# Altium schematic sheet 2014_FDP_SCHEMA.SchDoc
size A3
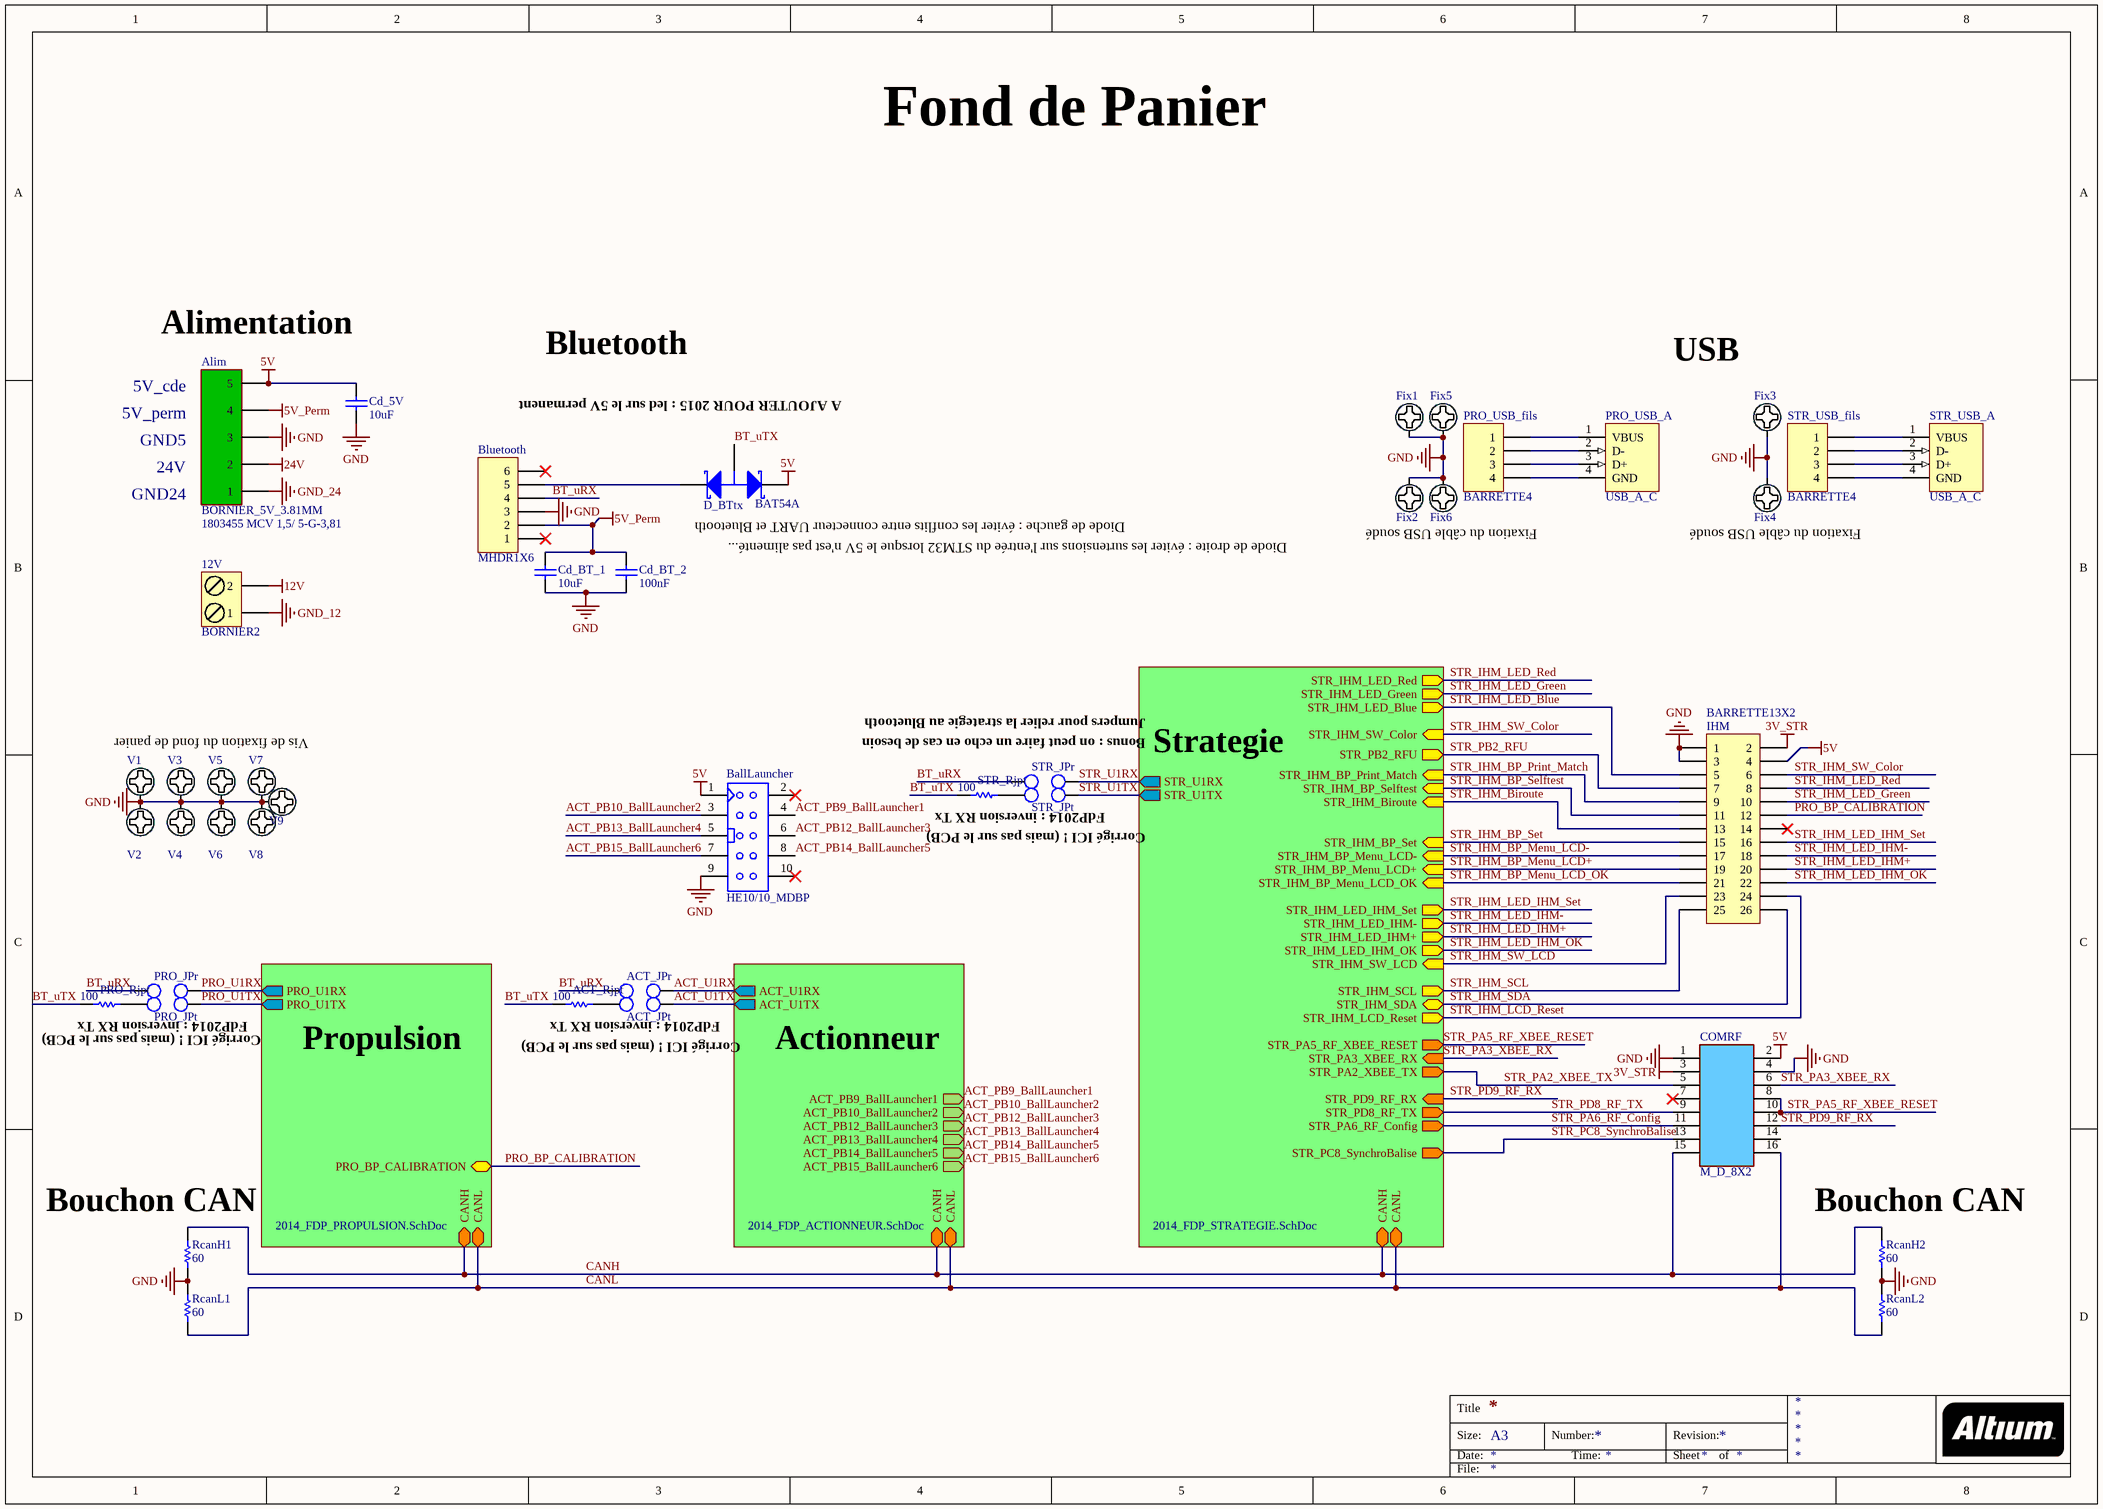
[diagram p0: 2014_FDP_SCHEMA.SchDoc]

## Parts
12V  BORNIER2  [BORNIER2]
ACT_JPr  JUMPER2  [BARRETTE_2_M_D]  (value not drawn)
ACT_JPt  JUMPER2  [BARRETTE_2_M_D]  (value not drawn)
ACT_Rjpt  100  [R1206_N]
Alim  BORNIER_5V_3.81MM  Ref: 1803455 MCV 1,5/ 5-G-3,81  [BORNIER_5V_3.81MM]
BallLauncher  Type: HE10/10_MDBP  [HE10/10_M_D_BP]  (hidden comment: HE10/10_MALE_DROIT_BAS_PROFIL)
Bluetooth  MHDR1X6  [HE14_6]
Cd_5V  10uF  [C1206_N]
Cd_BT_1  10uF  [C1206_N]
Cd_BT_2  100nF  [C0805_N]
COMRF  Type: M_D_8X2  [HE10/16_M_D_B P]  (hidden comment: BARRETTE_8 CONTACTS_2 RANGEES_MALE_DROITE)
D_BTtx  BAT54A  [SOT23-3N]
Fix1  Pad_M3  [M3x6mm Torx]  (value not drawn)
Fix2  Pad_M3  [M3x6mm Torx]  (value not drawn)
Fix3  Pad_M3  [M3x6mm Torx]  (value not drawn)
Fix4  Pad_M3  [M3x6mm Torx]  (value not drawn)
Fix5  Pad_M3  [M3x6mm Torx]  (value not drawn)
Fix6  Pad_M3  [M3x6mm Torx]  (value not drawn)
IHM  BARRETTE13X2  [HE10/26_M_D_BP]
PRO_JPr  JUMPER2  [BARRETTE_2_M_D]  (value not drawn)
PRO_JPt  JUMPER2  [BARRETTE_2_M_D]  (value not drawn)
PRO_Rjpt  100  [R1206_N]
PRO_USB_A  USB_A_COUDEE  [USB_A_C]  (value not drawn)
PRO_USB_fils  BARRETTE4  [HE14_4]
RcanH1  60  [R1206_N]
RcanH2  60  [R1206_N]
RcanL1  60  [R1206_N]
RcanL2  60  [R1206_N]
STR_JPr  JUMPER2  [BARRETTE_2_M_D]  (value not drawn)
STR_JPt  JUMPER2  [BARRETTE_2_M_D]  (value not drawn)
STR_Rjpt  100  [R1206_N]
STR_USB_A  USB_A_COUDEE  [USB_A_C]  (value not drawn)
STR_USB_fils  BARRETTE4  [HE14_4]
V1  Pad_M3  [M3x6mm Torx]  (value not drawn)
V2  Pad_M3  [M3x6mm Torx]  (value not drawn)
V3  Pad_M3  [M3x6mm Torx]  (value not drawn)
V4  Pad_M3  [M3x6mm Torx]  (value not drawn)
V5  Pad_M3  [M3x6mm Torx]  (value not drawn)
V6  Pad_M3  [M3x6mm Torx]  (value not drawn)
V7  Pad_M3  [M3x6mm Torx]  (value not drawn)
V8  Pad_M3  [M3x6mm Torx]  (value not drawn)
V9  Pad_M3  [M3x6mm Torx]  (value not drawn)

## Sub-sheets
Actionneur = 2014_FDP_ACTIONNEUR.SchDoc: CANH (bidir), CANL (bidir), ACT_PB9_BallLauncher1 (out), ACT_PB10_BallLauncher2 (out), ACT_PB12_BallLauncher3 (out), ACT_PB13_BallLauncher4 (out), ACT_PB14_BallLauncher5 (out), ACT_PB15_BallLauncher6 (out), ACT_U1RX (out), ACT_U1TX (out)
Propulsion = 2014_FDP_PROPULSION.SchDoc: PRO_BP_CALIBRATION, CANH (bidir), CANL (bidir), PRO_U1RX (out), PRO_U1TX (out)
Strategie = 2014_FDP_STRATEGIE.SchDoc: STR_IHM_BP_Set (in), STR_IHM_SW_LCD (in), STR_IHM_BP_Print_Match (in), STR_IHM_Biroute (in), STR_IHM_SW_Color (in), STR_IHM_BP_Selftest (in), STR_IHM_BP_Menu_LCD- (in), STR_IHM_BP_Menu_LCD+ (in), STR_IHM_SCL (out), STR_IHM_SDA (bidir), STR_IHM_LCD_Reset (out), STR_PA3_XBEE_RX (in), STR_PA2_XBEE_TX (out), STR_PA5_RF_XBEE_RESET (out), STR_PA6_RF_Config (out), STR_PC8_SynchroBalise (out), STR_PD8_RF_TX (out), STR_PD9_RF_RX (in), STR_IHM_BP_Menu_LCD_OK (in), STR_IHM_LED_Green (out), STR_IHM_LED_Red (out), STR_IHM_LED_IHM_OK (out), STR_IHM_LED_IHM+ (out), STR_IHM_LED_IHM- (out), STR_IHM_LED_IHM_Set (out), STR_PB2_RFU (out), CANL (bidir), CANH (bidir), STR_U1RX (out), STR_U1TX (out), STR_IHM_LED_Blue (out)

## Nets
3V_STR: COMRF.3 IHM.2
5V: Alim.5 BallLauncher.1 Cd_5V.2 COMRF.2 D_BTtx.2(K2) IHM.4
5V_Perm: Alim.4 Bluetooth.2 Cd_BT_1.2 Cd_BT_2.2
12V: 12V.2
24V: Alim.2
GND: Alim.3 BallLauncher.9 Bluetooth.3 Cd_5V.1 Cd_BT_1.1 Cd_BT_2.1 COMRF.1 COMRF.4 Fix1.1 Fix2.1 Fix3.1 Fix4.1 Fix5.1 Fix6.1 IHM.1 IHM.3 RcanH1.1 RcanH2.2 RcanL1.2 RcanL2.2 V1.1 V2.1 V3.1 V4.1 V5.1 V6.1 V7.1 V8.1 V9.1
GND_12: 12V.1
GND_24: Alim.1
ACT_PB9_BallLauncher1: BallLauncher.4 ; sheet Actionneur/ACT_PB9_BallLauncher1
ACT_PB10_BallLauncher2: BallLauncher.3 ; sheet Actionneur/ACT_PB10_BallLauncher2
ACT_PB12_BallLauncher3: BallLauncher.6 ; sheet Actionneur/ACT_PB12_BallLauncher3
ACT_PB13_BallLauncher4: BallLauncher.5 ; sheet Actionneur/ACT_PB13_BallLauncher4
ACT_PB14_BallLauncher5: BallLauncher.8 ; sheet Actionneur/ACT_PB14_BallLauncher5
ACT_PB15_BallLauncher6: BallLauncher.7 ; sheet Actionneur/ACT_PB15_BallLauncher6
ACT_U1RX: ACT_JPr.2 ; sheet Actionneur/ACT_U1RX
ACT_U1TX: ACT_JPt.2 ; sheet Actionneur/ACT_U1TX
BT_uRX: ACT_JPr.1 Bluetooth.4 PRO_JPr.1 STR_JPr.1
BT_uTX: ACT_Rjpt.2 D_BTtx.3(A) PRO_Rjpt.2 STR_Rjpt.2
CANH: COMRF.15 RcanH1.2 RcanH2.1 ; sheet Propulsion/CANH, sheet Strategie/CANH, sheet Actionneur/CANH
CANL: COMRF.16 RcanL1.1 RcanL2.1 ; sheet Propulsion/CANL, sheet Strategie/CANL, sheet Actionneur/CANL
PRO_BP_CALIBRATION: IHM.12 ; sheet Propulsion/PRO_BP_CALIBRATION
PRO_U1RX: PRO_JPr.2 ; sheet Propulsion/PRO_U1RX
PRO_U1TX: PRO_JPt.2 ; sheet Propulsion/PRO_U1TX
STR_IHM_Biroute: IHM.13 ; sheet Strategie/STR_IHM_Biroute
STR_IHM_BP_Menu_LCD+: IHM.19 ; sheet Strategie/STR_IHM_BP_Menu_LCD+
STR_IHM_BP_Menu_LCD-: IHM.17 ; sheet Strategie/STR_IHM_BP_Menu_LCD-
STR_IHM_BP_Menu_LCD_OK: IHM.21 ; sheet Strategie/STR_IHM_BP_Menu_LCD_OK
STR_IHM_BP_Print_Match: IHM.9 ; sheet Strategie/STR_IHM_BP_Print_Match
STR_IHM_BP_Selftest: IHM.11 ; sheet Strategie/STR_IHM_BP_Selftest
STR_IHM_BP_Set: IHM.15 ; sheet Strategie/STR_IHM_BP_Set
STR_IHM_LCD_Reset: IHM.24 ; sheet Strategie/STR_IHM_LCD_Reset
STR_IHM_LED_Blue: IHM.5 ; sheet Strategie/STR_IHM_LED_Blue
STR_IHM_LED_Green: IHM.10 ; sheet Strategie/STR_IHM_LED_Green
STR_IHM_LED_IHM+: IHM.20 ; sheet Strategie/STR_IHM_LED_IHM+
STR_IHM_LED_IHM-: IHM.18 ; sheet Strategie/STR_IHM_LED_IHM-
STR_IHM_LED_IHM_OK: IHM.22 ; sheet Strategie/STR_IHM_LED_IHM_OK
STR_IHM_LED_IHM_Set: IHM.16 ; sheet Strategie/STR_IHM_LED_IHM_Set
STR_IHM_LED_Red: IHM.8 ; sheet Strategie/STR_IHM_LED_Red
STR_IHM_SCL: IHM.25 ; sheet Strategie/STR_IHM_SCL
STR_IHM_SDA: IHM.26 ; sheet Strategie/STR_IHM_SDA
STR_IHM_SW_Color: IHM.6 ; sheet Strategie/STR_IHM_SW_Color
STR_IHM_SW_LCD: IHM.23 ; sheet Strategie/STR_IHM_SW_LCD
STR_PA2_XBEE_TX: COMRF.5 ; sheet Strategie/STR_PA2_XBEE_TX
STR_PA3_XBEE_RX: COMRF.6 ; sheet Strategie/STR_PA3_XBEE_RX
STR_PA5_RF_XBEE_RESET: COMRF.8 COMRF.10 ; sheet Strategie/STR_PA5_RF_XBEE_RESET
STR_PA6_RF_Config: COMRF.11 ; sheet Strategie/STR_PA6_RF_Config
STR_PB2_RFU: IHM.7 ; sheet Strategie/STR_PB2_RFU
STR_PC8_SynchroBalise: COMRF.13 ; sheet Strategie/STR_PC8_SynchroBalise
STR_PD8_RF_TX: COMRF.9 ; sheet Strategie/STR_PD8_RF_TX
STR_PD9_RF_RX: COMRF.12 ; sheet Strategie/STR_PD9_RF_RX
STR_U1RX: STR_JPr.2 ; sheet Strategie/STR_U1RX
STR_U1TX: STR_JPt.2 ; sheet Strategie/STR_U1TX
NetACT_JPt_1: ACT_JPt.1 ACT_Rjpt.1
NetBluetooth_5: Bluetooth.5 D_BTtx.1(K1)
NetPRO_JPt_1: PRO_JPt.1 PRO_Rjpt.1
NetPRO_USB_A_1: PRO_USB_A.1(VBUS) PRO_USB_fils.1
NetPRO_USB_A_2: PRO_USB_A.2(D-) PRO_USB_fils.2
NetPRO_USB_A_3: PRO_USB_A.3(D+) PRO_USB_fils.3
NetPRO_USB_A_4: PRO_USB_A.4(GND) PRO_USB_fils.4
NetSTR_JPt_1: STR_JPt.1 STR_Rjpt.1
NetSTR_USB_A_1: STR_USB_A.1(VBUS) STR_USB_fils.1
NetSTR_USB_A_2: STR_USB_A.2(D-) STR_USB_fils.2
NetSTR_USB_A_3: STR_USB_A.3(D+) STR_USB_fils.3
NetSTR_USB_A_4: STR_USB_A.4(GND) STR_USB_fils.4

Not connected (* = marked no-connect by the designer): BallLauncher 2* 10*; Bluetooth 1* 6*; COMRF 7* 14; IHM 14*

## Notes on the sheet
- Fond de Panier
- Alimentation
- Bluetooth
- USB
- 5V_perm
- 5V_cde
- GND5
- A AJOUTER POUR 2015 : led sur le 5V permanent
- 24V
- GND24
- Diode de gauche : éviter les conflits entre connecteur UART et Bluetooth
- (near Cd_BT_2) Diode de droite : éviter les surtensions sur l'entrée du STM32 lorsque le 5V n'est pas alimenté...
- Fixation du câble USB soudé
- Jumpers pour relier la strategie au Bluetooth
- Vis de fixation du fond de panier
- Bonus : on peut faire un echo en cas de besoin
- FdP2014 : inversion RX Tx
- Corrigé ICI ! (mais pas sur le PCB)
- (near RcanH1) Bouchon CAN
- (near RcanH2) Bouchon CAN
- Title
- Size:
- Date:
- A3
- Number:
- Time:
- Revision:
- Sheet
- of
- File:

## Library data of the parts
12V = BORNIER2: Terminal blocks, 2 pins, pitch=5mm
ACT_JPr ACT_JPt PRO_JPr PRO_JPt STR_JPr STR_JPt = JUMPER2: BARRETTE 2 CONTACTS 1 RANGEE MALE DROITE; Type: JUMPER2
ACT_Rjpt PRO_Rjpt RcanH1 RcanH2 RcanL1 RcanL2 STR_Rjpt = Resistor: Published: 8-Jun-2000; LatestRevisionDate: 17-Jul-2002; LatestRevisionNote: Re-released for DXP Platform.; PackageReference: AXIAL-0.5; Publisher: Altium Limited
BallLauncher = HE10/10_MALE_DROIT_BAS_PROFIL: EMBASE HE10/10 MALE DROIT BAS PROFIL
Bluetooth = MHDR1X6: Header, 6-Pin; LatestRevisionDate: 17-Jul-2002; LatestRevisionNote: Re-released for DXP Platform.; Publisher: Altium Limited
Cd_5V Cd_BT_1 Cd_BT_2 = Condensateur: Capacitor; Published: 8-Jun-2000; LatestRevisionDate: 17-Jul-2002; LatestRevisionNote: Re-released for DXP Platform.; PackageReference: RAD-0.3; Publisher: Altium Limited
D_BTtx = Diode Shottky double  BAT54A: DIODE SCHOTTKY DOUBLE; Manufacturer: ZETEX; Description: ZETEX - BAT54A - DIODE SCHOTTKY DOUBLE; ComponentLink1URL: http://www.farnell.com/datasheets/27632.pdf; ComponentLink1Description: http://www.farnell.com/datasheets/27632.pdf; Supplier Part Number: 9526498; Supplier: Farnell; RoHS: YES; Manufacturer Part Number: BAT54A
Fix1-Fix6 V1-V9 = Vis M3 X 6mm _TORX_Tête 6mm: Publisher: Damien Guitton
IHM = BARRETTE13X2: Header, 13-Pin, Dual row; LatestRevisionDate: 17-Jul-2002; LatestRevisionNote: Re-released for DXP Platform.; Publisher: Altium Limited
PRO_USB_A STR_USB_A = USB_A_COUDEE: EMBASE USB TRAVERSANTE TYPE A COUDEE; Type: USB_A_C
PRO_USB_fils STR_USB_fils = BARRETTE4: Header, 4-Pin; LatestRevisionDate: 17-Jul-2002; LatestRevisionNote: Re-released for DXP Platform.; Publisher: Altium Limited